# EAGLE schematic driver_pa (EAGLE 7.2.0)
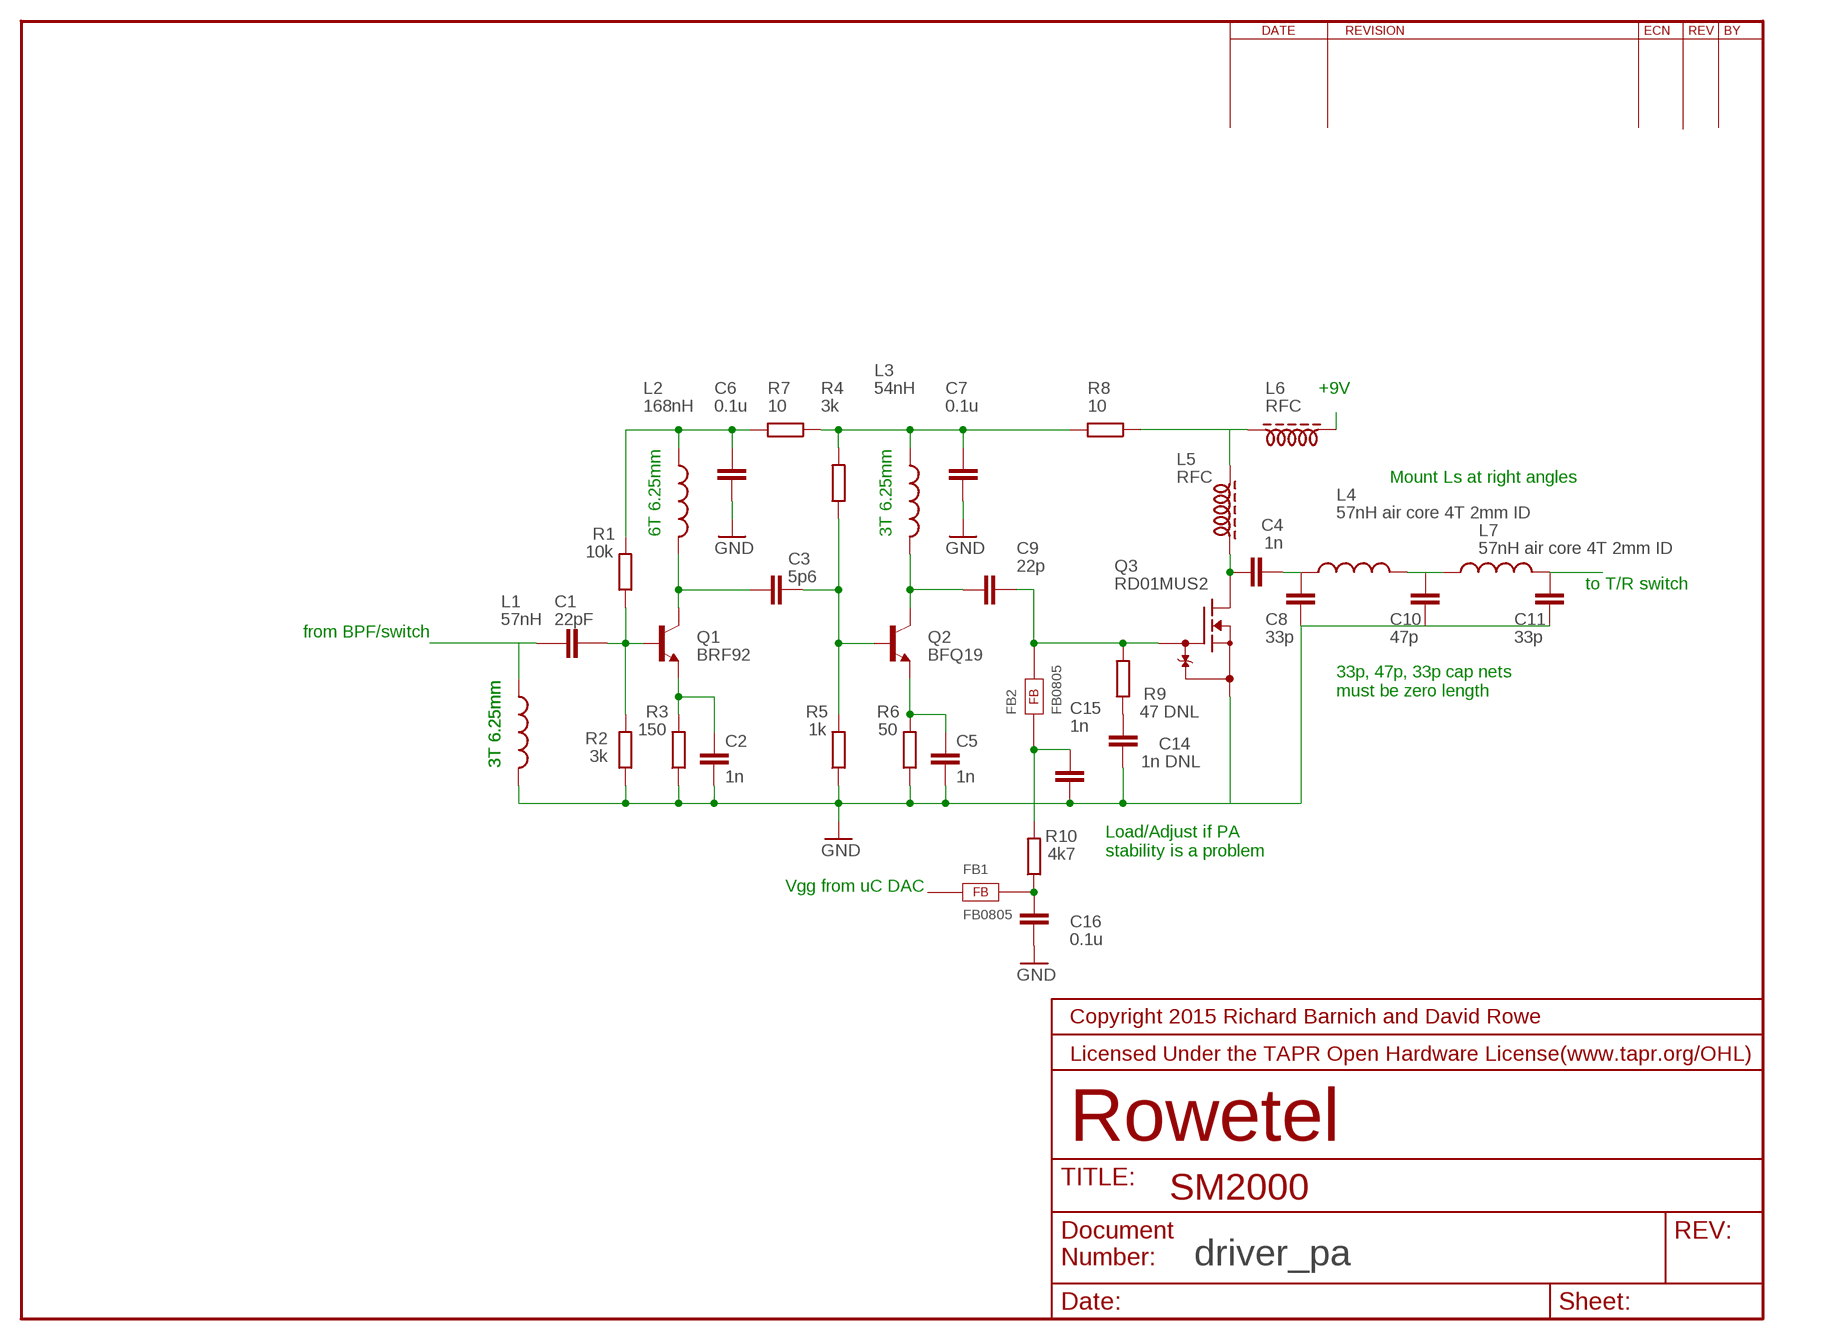
[diagram p0: schematic, sheet 1]

## Parts
C1  22pF  CAPACITOR_0805  [CAPC2012X145AN]
C2  1n  C-EU025-024X044  [C025-024X044]
C3  5p6  C-EU025-024X044  [C025-024X044]
C4  1n  C-EU025-024X044  [C025-024X044]
C5  1n  C-EU025-024X044  [C025-024X044]
C6  0.1u  C-EU025-024X044  [C025-024X044]
C7  0.1u  C-EU025-024X044  [C025-024X044]
C8  33p  C-EU025-024X044  [C025-024X044]
C9  22p  C-EU025-024X044  [C025-024X044]
C10  47p  C-EU025-024X044  [C025-024X044]
C11  33p  C-EU025-024X044  [C025-024X044]
C14  1n DNL  C-EU025-024X044  [C025-024X044]
C15  1n  C-EU025-024X044  [C025-024X044]
C16  0.1u  C-EU025-024X044  [C025-024X044]
FB1  FB0805  [FE0805]
FB2  FB0805  [FE0805]
L1  57nH  L-US0204/5  [0204/5]
L2  168nH  L-US0204/5  [0204/5]
L3  54nH  L-US0204/5  [0204/5]
L4  57nH air core 4T 2mm ID  L-US0204/5  [0204/5]
L5  RFC  Z14/40CCW  [Z15/4]
L6  RFC  Z14/40CCW  [Z15/4]
L7  57nH air core 4T 2mm ID  L-US0204/5  [0204/5]
Q1  BRF92  -NPN-SOT23-EBC  [SOT23-EBC]
Q2  BFQ19  -NPN-SOT23-EBC  [SOT23-EBC]
Q3  RD01MUS2  [SOT89]
R1  10k  RESISTOR_0805  [RESC2012X70N]
R2  3k  RESISTOR_0805  [RESC2012X70N]
R3  150  RESISTOR_0805  [RESC2012X70N]
R4  3k  RESISTOR_0805  [RESC2012X70N]
R5  1k  RESISTOR_0805  [RESC2012X70N]
R6  50  RESISTOR_0805  [RESC2012X70N]
R7  10  RESISTOR_0805  [RESC2012X70N]
R8  10  RESISTOR_0805  [RESC2012X70N]
R9  47 DNL  RESISTOR_0805  [RESC2012X70N]
R10  4k7  RESISTOR_0805  [RESC2012X70N]

## Nets
GND: C2.2 C5.2 C6.2 C7.2 C8.2 C11.2 C14.2 C15.2 C16.2 L1.2 Q3.2(S) Q3.2.1(S) R2.1 R3.1 R5.1 R6.1
N$1: C2.1 Q1.E R3.2
N$2: C14.1 R9.1
N$3: C1.1 Q1.B R1.1 R2.2
N$4: C5.1 Q2.E R6.2
N$5: C15.1 FB2.1 R10.2
N$6: L5.2 L6.2 R8.1
N$7: C4.2 C8.1 L4.1
N$8: C10.1 L4.2 L7.1
N$9: C3.2 L2.2 Q1.C
N$10: C6.1 L2.1 R1.2 R7.2
N$11: C7.1 L3.1 R4.2 R7.1 R8.2
N$12: C11.1 L7.2
N$13: C9.2 L3.2 Q2.C
N$14: C3.1 Q2.B R4.1 R5.2
N$15: C9.1 FB2.2 Q3.1(G) R9.2
N$17: C1.2 L1.1
N$18: C16.1 FB1.2 R10.1
N$19: L6.1
N$20: C4.1 L5.1 Q3.3(D)
Unconnected: C10.2 FB1.1

## Notes on the sheet
- +9V
- Mount Ls at right angles
- 6T 6.25mm | 3T 6.25mm
- to T/R switch
- from BPF/switch
- 33p, 47p, 33p cap nets
  must be zero length
- 3T 6.25mm | 3T 6.25mm
- Load/Adjust if PA
  stability is a problem
- Vgg from uC DAC
- SM2000

## Library data of the parts
C1 = AA-ipc-7351-capacitor:CAPACITOR_
C2-C11 C14-C16 = rcl:C-EU: CAPACITOR, European symbol
FB1 FB2 = _RoweTel:FB0805
L1-L4 L7 = rcl:L-US: INDUCTOR, American symbol
L5 L6 = inductor-neosid:Z?CCW: CHOKE free-suspension choke/nominal inductance winding counter clockwise; OC_FARNELL: unknown; OC_NEWARK: unknown
Q1 Q2 = transistor:*-NPN-: NPN Transistror BF959 corrected 2008.03.06
Q3 = _RoweTel:RD01MUS2
R1-R10 = AA-ipc-7351-resistor:RESISTOR_